# Altium schematic sheet obc-v2_EXP-CAN-RS422.SchDoc
size 420 x 297 mm; SheetNumber: 14; SheetTotal: 23
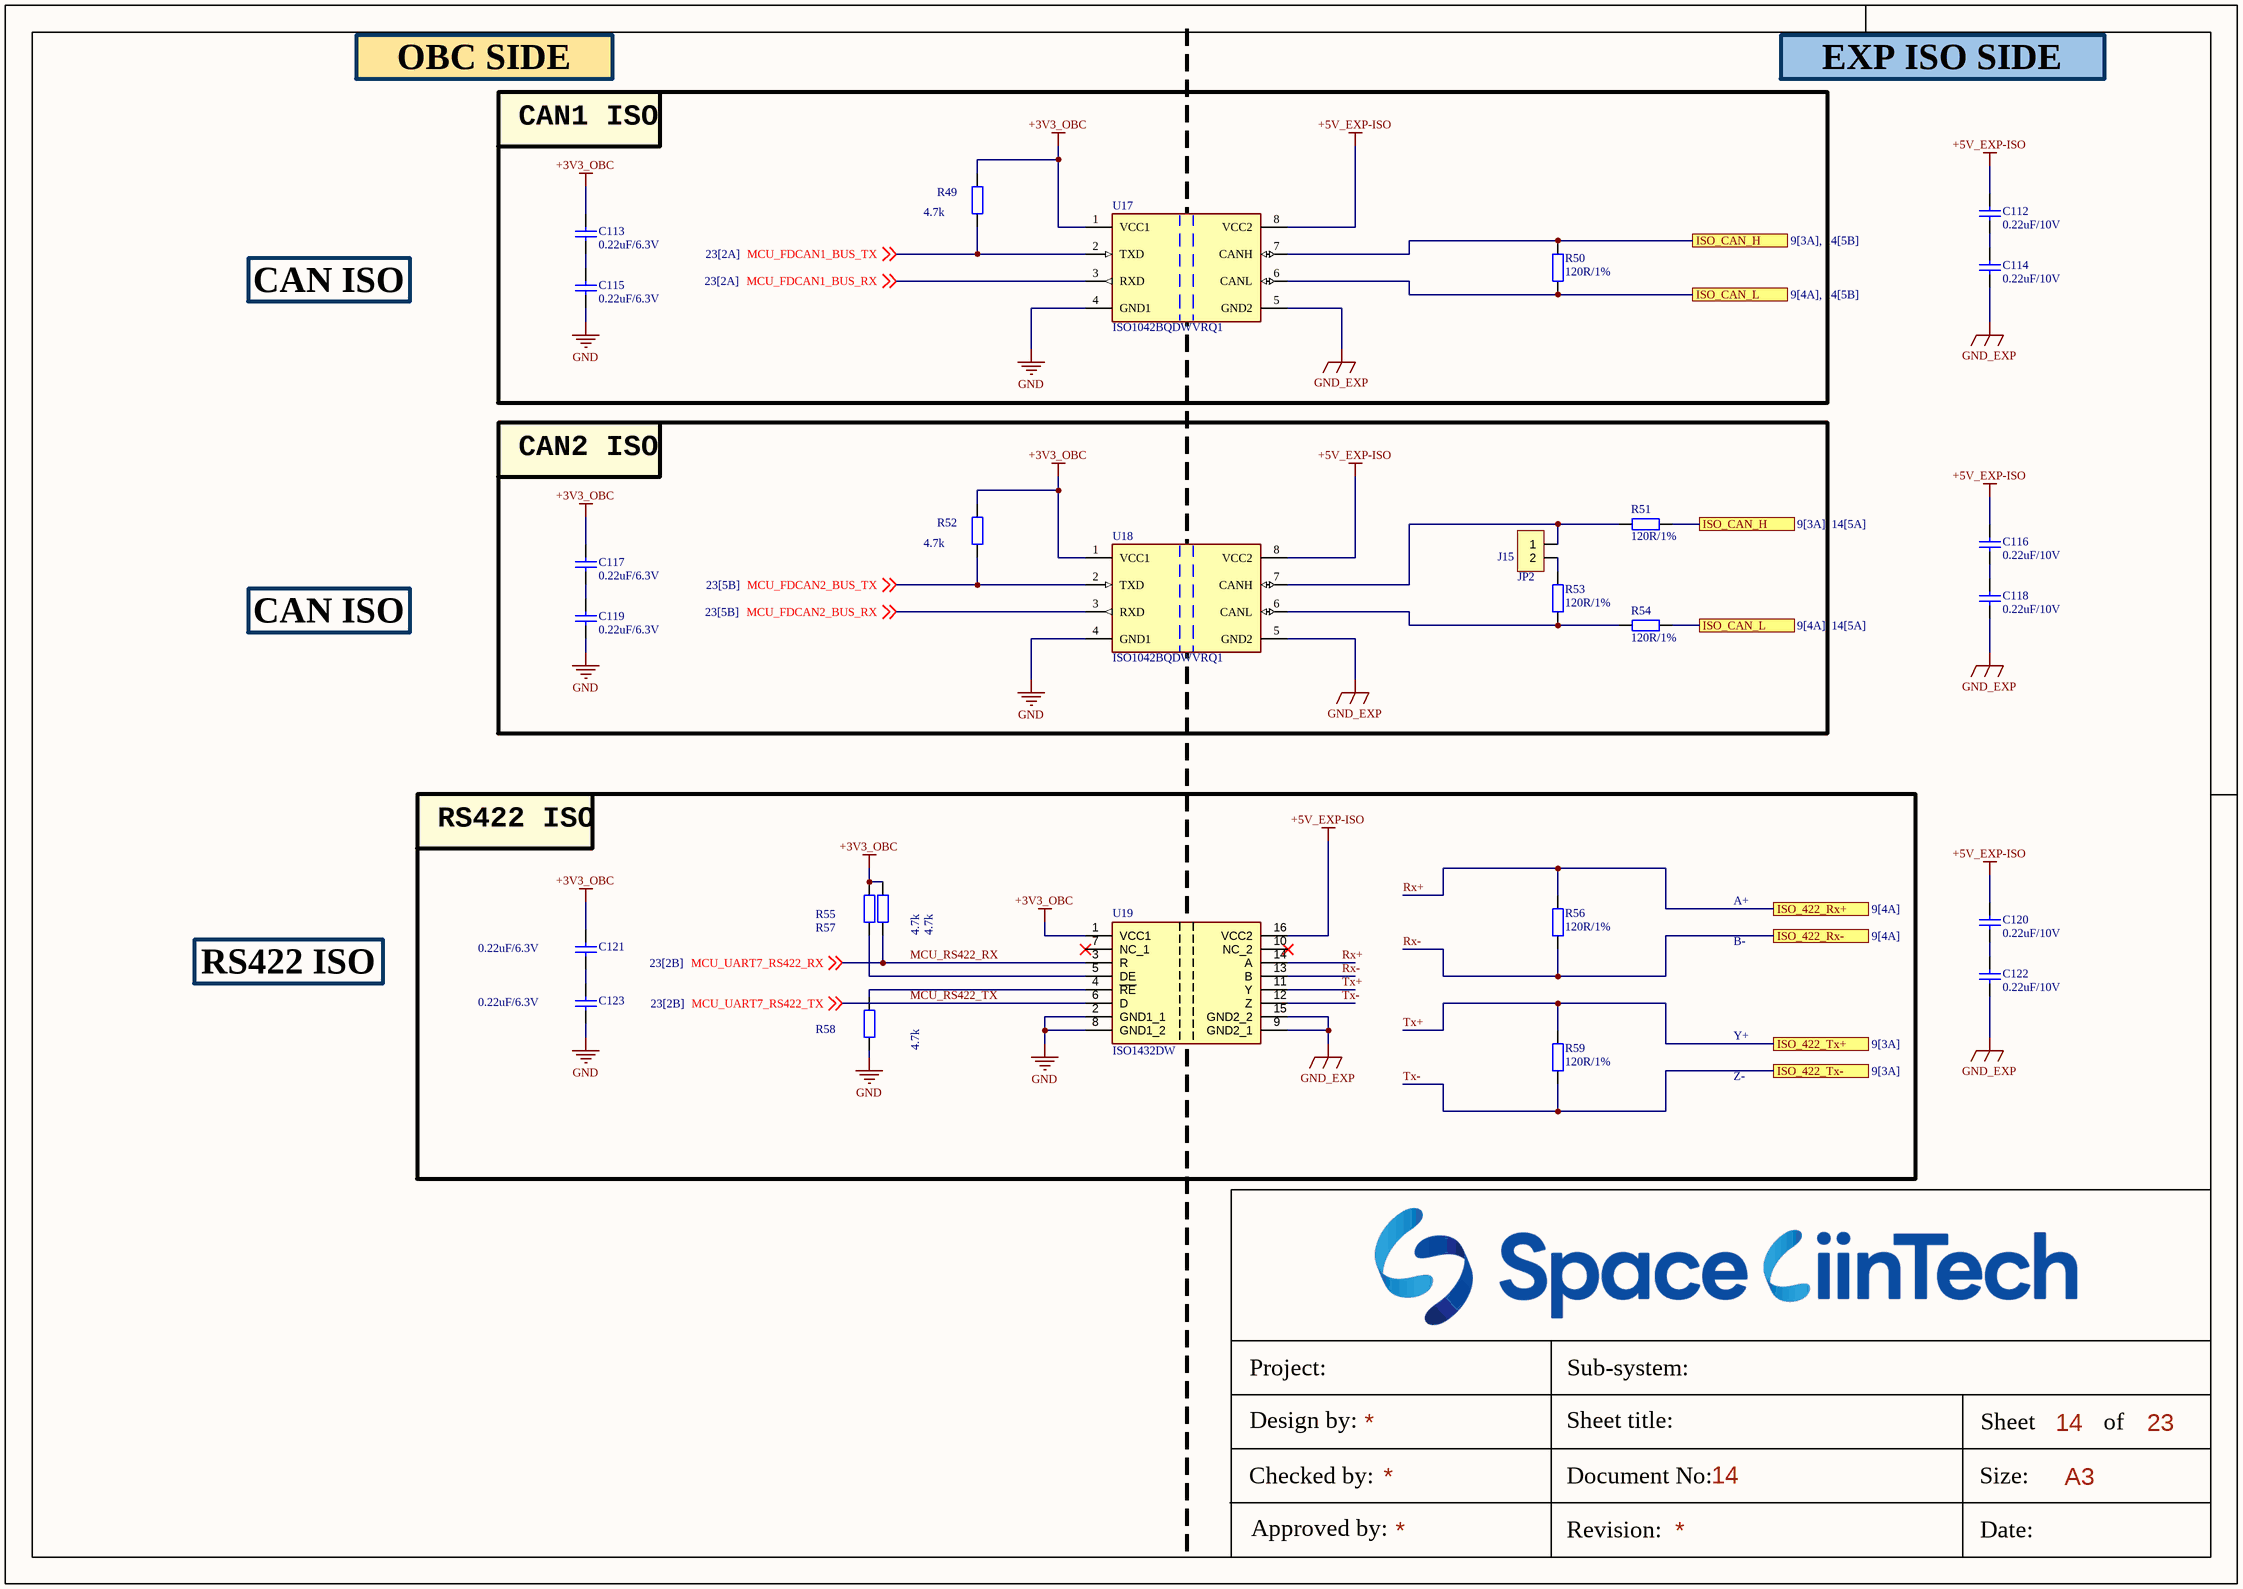
[diagram p0: obc-v2_EXP-CAN-RS422.SchDoc]

## Parts
C112  0.22uF/10V  [CAP_C_1005X60]
C113  0.22uF/6.3V  [CAP_C_1005X60]
C114  0.22uF/10V  [CAP_C_1005X60]
C115  0.22uF/6.3V  [CAP_C_1005X60]
C116  0.22uF/10V  [CAP_C_1005X60]
C117  0.22uF/6.3V  [CAP_C_1005X60]
C118  0.22uF/10V  [CAP_C_1005X60]
C119  0.22uF/6.3V  [CAP_C_1005X60]
C120  0.22uF/10V  [CAP_C_1005X60]
C121  0.22uF/6.3V  [CAP_C_1005X60]
C122  0.22uF/10V  [CAP_C_1005X60]
C123  0.22uF/6.3V  [CAP_C_1005X60]
J15  JP2  [JP2-D1T]
R49  4.7k  [RES_C_1608X60]
R50  120R/1%  [RES_C_1608X60]
R51  120R/1%  [RES_C_1608X60]
R52  4.7k  [RES_C_1608X60]
R53  120R/1%  [RES_C_1608X60]
R54  120R/1%  [RES_C_1608X60]
R55  4.7k  [RES_C_1608X60]
R56  120R/1%  [RES_C_1608X60]
R57  4.7k  [RES_C_1608X60]
R58  4.7k  [RES_C_1608X60]
R59  120R/1%  [RES_C_1608X60]
U17  ISO1042BQDWVRQ1  [FP-DWV0008A-IPC_B]
U18  ISO1042BQDWVRQ1  [FP-DWV0008A-IPC_B]
U19  ISO1432DW  [SOIC127P1030X265-16N]

## Blocks framed on the sheet
CAN1 ISO: C113 C115 R49 R50 U17
CAN2 ISO: C117 C119 J15 R51-R54 U18
RS422 ISO: C121 C123 R55-R59 U19

## Ports
ISO_422_Rx+ (see 9[4A]), ISO_422_Rx- (see 9[4A]), ISO_422_Tx+ (see 9[3A]), ISO_422_Tx- (see 9[3A]), ISO_CAN_H (see 9[3A], 14[5A]), ISO_CAN_H (see 9[3A], 14[5B]), ISO_CAN_L (see 9[4A], 14[5A]), ISO_CAN_L (see 9[4A], 14[5B])

## Nets
+3V3_OBC: C113.1 C117.1 C121.1 R49.2 R52.2 R55.2 R57.2 U17.1(VCC1) U18.1(VCC1) U19.1(VCC1)
+5V_EXP-ISO: C112.1 C116.1 C120.2 U17.8(VCC2) U18.8(VCC2) U19.16(VCC2)
GND: C115.2 C119.2 C123.2 R58.1 U17.4(GND1) U18.4(GND1) U19.2(GND1_1) U19.8(GND1_2)
GND_EXP: C114.2 C118.2 C122.1 U17.5(GND2) U18.5(GND2) U19.9(GND2_1) U19.15(GND2_2)
ISO_CAN_H: R50.2 R51.1 U17.7(CANH) ; port ISO_CAN_H
ISO_CAN_L: R50.1 R54.1 U17.6(CANL) ; port ISO_CAN_L
MCU_FDCAN1_BUS_RX: U17.3(RXD) ; off-sheet MCU_FDCAN1_BUS_RX
MCU_FDCAN1_BUS_TX: R49.1 U17.2(TXD) ; off-sheet MCU_FDCAN1_BUS_TX
MCU_FDCAN2_BUS_RX: U18.3(RXD) ; off-sheet MCU_FDCAN2_BUS_RX
MCU_FDCAN2_BUS_TX: R52.1 U18.2(TXD) ; off-sheet MCU_FDCAN2_BUS_TX
MCU_RS422_RX: R57.1 U19.3(R) ; off-sheet MCU_UART7_RS422_RX  [also labelled MCU_UART7_RS422_RX]
MCU_RS422_TX: U19.6(D) ; off-sheet MCU_UART7_RS422_TX  [also labelled MCU_UART7_RS422_TX]
Rx+: R56.2 U19.14(A) ; port ISO_422_Rx+
Rx-: R56.1 U19.13(B) ; port ISO_422_Rx-
Tx+: R59.2 U19.11(Y) ; port ISO_422_Tx+
Tx-: R59.1 U19.12(Z) ; port ISO_422_Tx-
NetC112_2: C112.2 C114.1
NetC113_2: C113.2 C115.1
NetC116_2: C116.2 C118.1
NetC117_2: C117.2 C119.1
NetC120_1: C120.1 C122.2
NetC121_2: C121.2 C123.1
NetJ15_1: J15.1 R51.2 U18.7(CANH)
NetJ15_2: J15.2 R53.2
NetR53_1: R53.1 R54.2 U18.6(CANL)
NetR55_1: R55.1 U19.5(DE)
NetR58_2: R58.2 U19.4(~{RE})

Not connected (* = marked no-connect by the designer): U19 7(NC_1)* 10(NC_2)*

## Notes on the sheet
- OBC SIDE
- EXP ISO SIDE
- CAN ISO
- A+
- RS422 ISO
- B-
- Y+
- Z-
- Project:
- Sub-system:
- Design by:
- Sheet title:
- Sheet
- A3
- of
- Checked by:
- Approved by:
- Revision:
- Document No:
- Size:
- Date:

## Library data of the parts
C112-C123 = Tu 0402 33nF 10V: CAPC; Chung_Loai: Dán; Don_Vi: Con; So_Chan: 2; Ten_Linh_Kien: Tụ 0402 33nF X7R 10V GRM155R71A333KA01D; Ma_Hang: MH007853; Kieu_Chan: *
J15 = JP2: WR-PHD 2.54 mm Angled Socket Header; Manufacturer: W¨¹rth Elektronik eiSos GmbH; partNo: 613002143121; ComponentLink1 Description: Manufacturer; ComponentLink2 Description: Datasheet; NoPins: 02; Created Date: 29 March 2013; ComponentLink1URL: http://www.we-online.com; ComponentLink2URL: http://katalog.we-online.de/em/datasheet/6130xx143121.pdf; Created by: Karrer Zheng
R49-R59 = Tro 0603 1% 10k: RES; Chung_Loai: Dán; Don_Vi: Con; So_Chan: 2; Ten_Linh_Kien: Trở 0603 1% 10k; Ma_Hang: MH006333; Kieu_Chan: *
U17 U18 = CMP-04872-000086-1: TRANSCEIVER; RoHS Compliant: Yes
U19 = ISO1432DWR: RS-422/RS-485 Interface IC 5-kVrms isolated RS-485/RS-422 transceiver with robust EMC 16-SOIC -40 to 125; Manufacturer_Name: Texas Instruments; Manufacturer_Part_Number: ISO1430DW; Geometry.Height: 2.65mm; Mouser Part Number: 595-ISO1430DW; Mouser Price/Stock: https://www.mouser.co.uk/ProductDetail/Texas-Instruments/ISO1430DW?qs=EBDBlbfErPzpJh5zkcdiFg%3D%3D; Arrow Part Number: ISO1430DW; Arrow Price/Stock: https://www.arrow.com/en/products/iso1430dw/texas-instruments?region=nac; Datasheet Link: https://datasheet.datasheetarchive.com/originals/distributors/Datasheets_SAMA/30467ff99f72399b87c3bb1b8b60cbd8.pdf